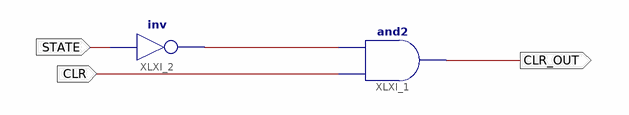
[diagram p0: schematic sheet 1]
// Xilinx ISE schematic Clear.sch (spartan6) as structural Verilog: 2 symbols, 3 ports
module Clear (
  input  CLR,
  input  STATE,
  output CLR_OUT
);

  wire XLXN_1;

  and XLXI_1 (CLR_OUT, CLR, XLXN_1);
  not XLXI_2 (XLXN_1, STATE);
endmodule
